# Altium schematic sheet commucational.SchDoc
size A1; Organization: Protel International P/L; Address1: L3, 12a Rodborough Rd; Address2: Frenchs Forest; Address3: NSW; Address4: Australia 2086
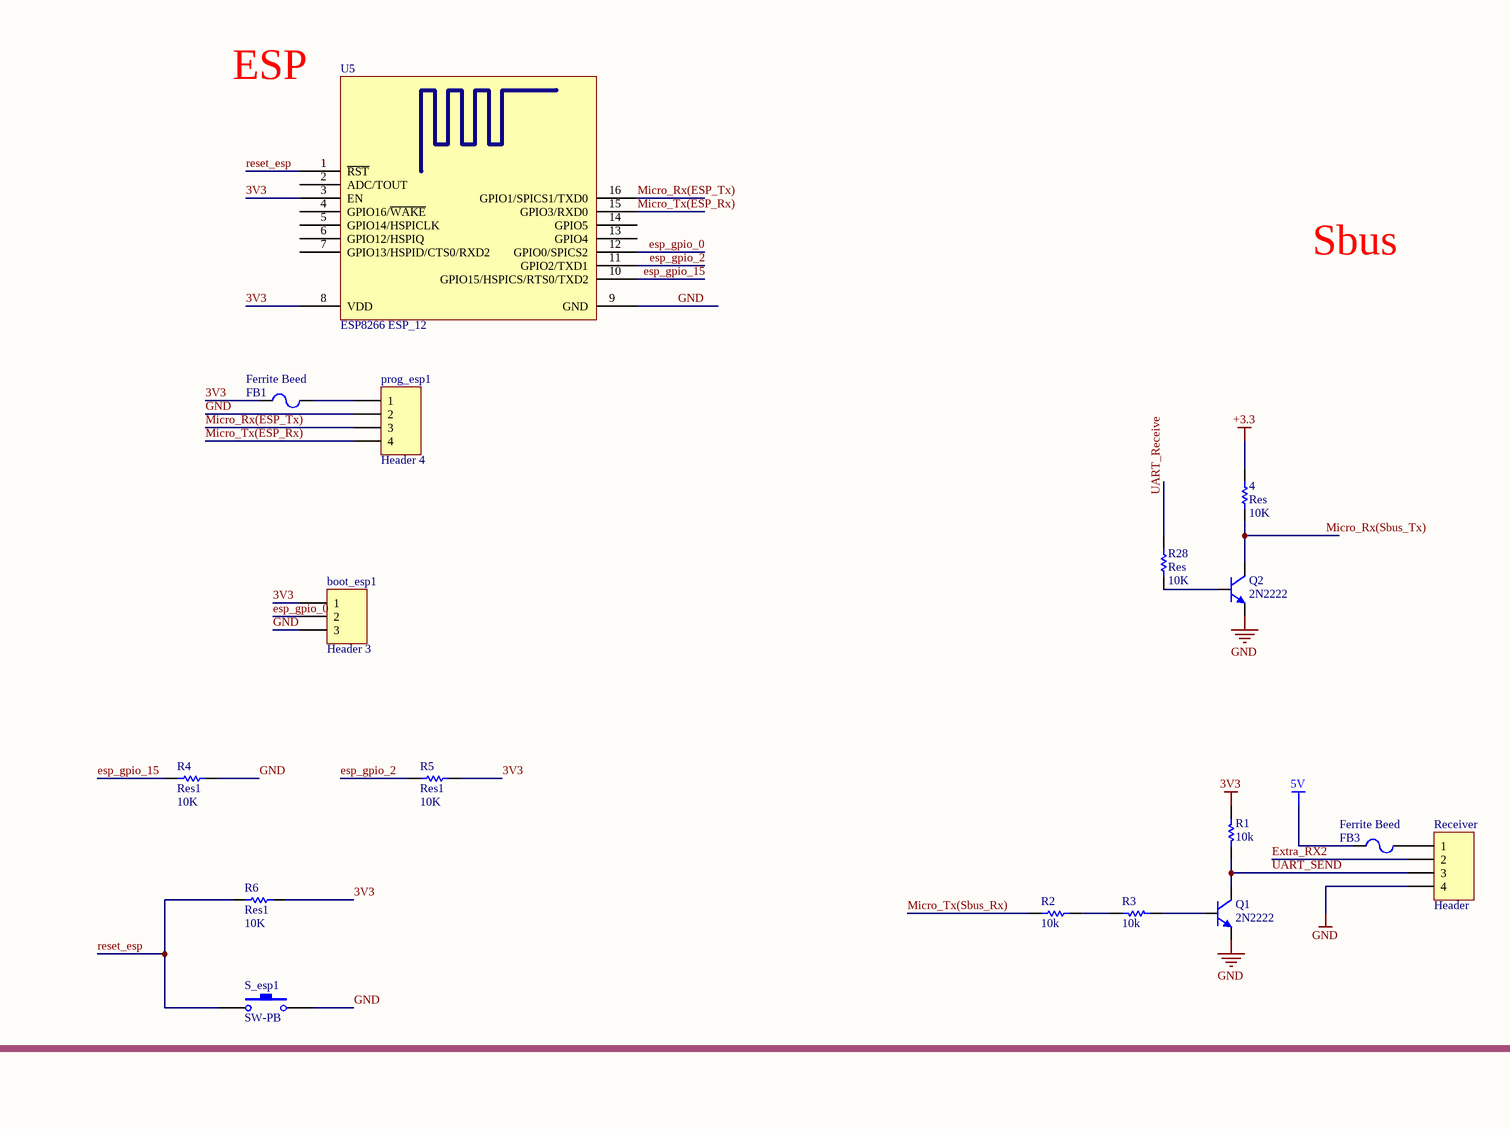
[diagram p0: commucational.SchDoc, top left]
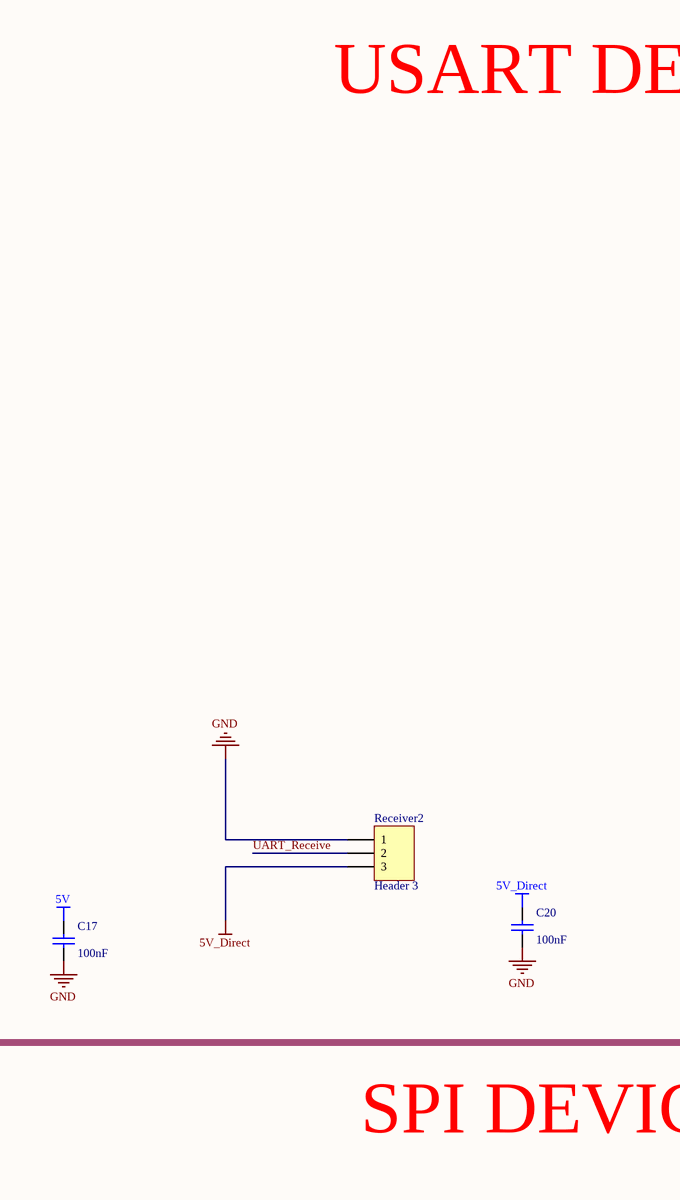
[diagram p1: commucational.SchDoc, top middle]
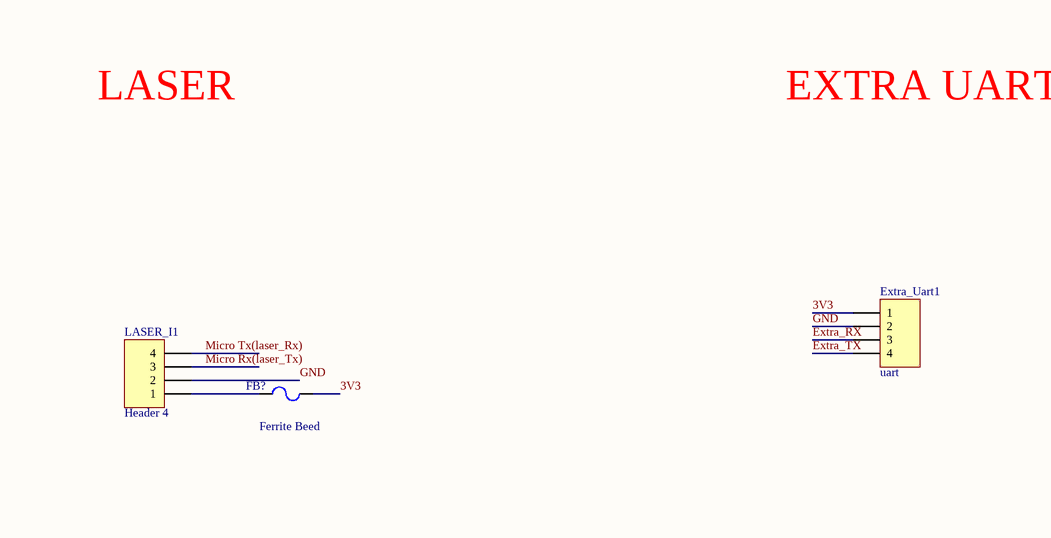
[diagram p2: commucational.SchDoc, top right]
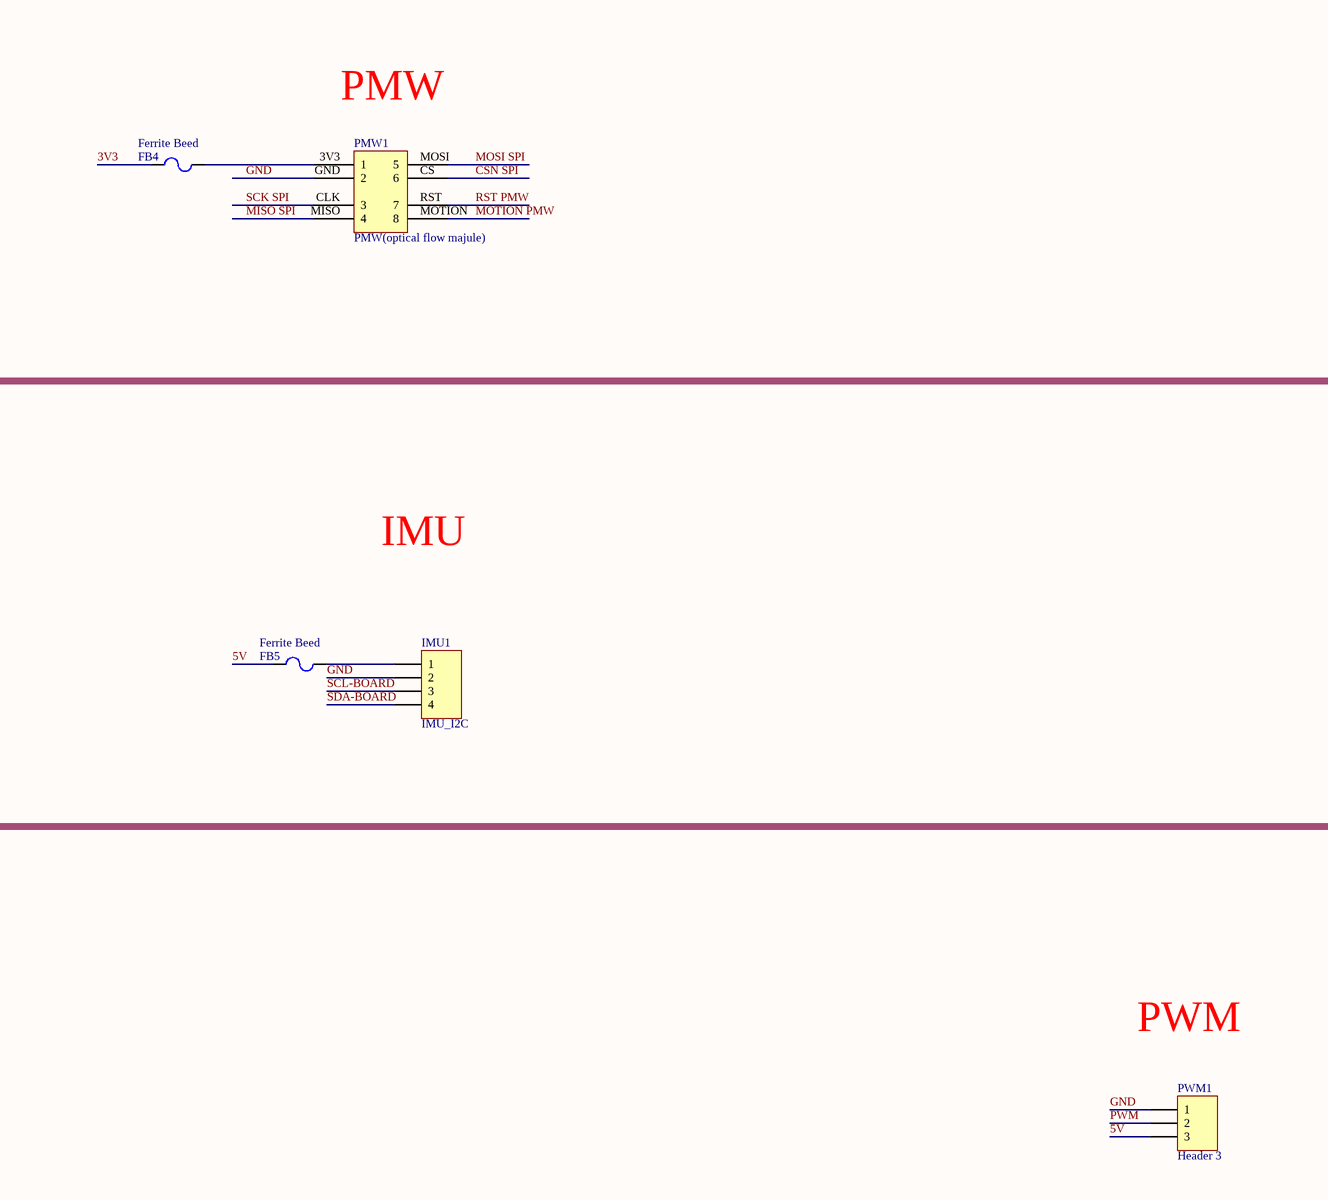
[diagram p3: commucational.SchDoc, bottom left]
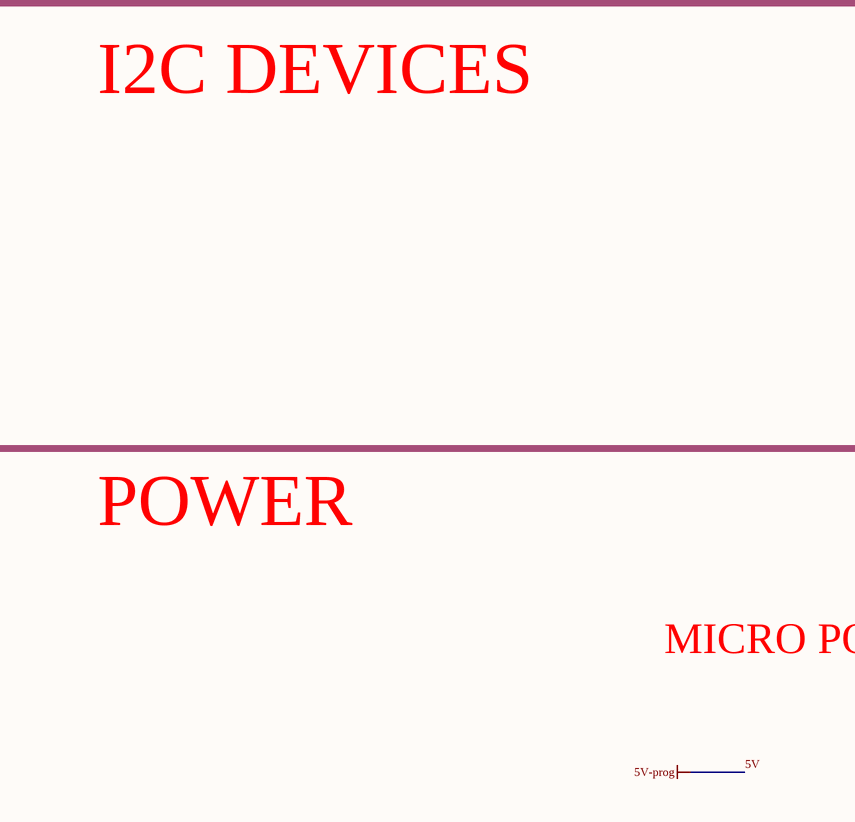
[diagram p4: commucational.SchDoc, bottom middle]

## Parts
4  Res  value 10K  [J1-0603]
boot_esp1  Header 3  [HDR1X3]
C17  value 100nF  [j1-0603]
C20  value 100nF  [j1-0603]
Extra_Uart1  uart  [SHeader 4]
FB1  Ferrite Beed  [6-0805_L]
FB3  Ferrite Beed  [6-0805_L]
FB4  Ferrite Beed  [6-0805_L]
FB5  Ferrite Beed  [6-0805_L]
FB?  Ferrite Beed  [6-0805_L]
IMU1  IMU_I2C  [SHeader 4]
LASER_I1  Header 4  [SHeader 4]
PMW1  PMW(optical flow majule)  [PMW(optical flow)]
prog_esp1  Header 4  [SHeader 4]
PWM1  Header 3  [SHeader 3]
Q1  2N2222  [SOT-23]
Q2  2N2222  [SOT-23]
R1  10k  [J1-0603]
R2  10k  [J1-0603]
R3  10k  [J1-0603]
R4  Res1  value 10K  [J1-0603]
R5  Res1  value 10K  [J1-0603]
R6  Res1  value 10K  [J1-0603]
R28  Res  value 10K  [J1-0603]
Receiver  Header  [SHeader 4]
Receiver2  Header 3  [SHeader 3]
S_esp1  SW-PB  [SW-PB-4P]
U5  ESP8266 ESP_12  [ESP8266 ESP_12]

## Nets
3V3: boot_esp1.1 Extra_Uart1.1 FB1.1 FB4.1 FB?.2 R1.2 R5.2 R6.2 U5.3(EN) U5.8(VDD)
5V: C17.2 FB3.1 FB5.1 PWM1.3  [also labelled 5V-prog]
5V_Direct: C20.2 Receiver2.3
+3.3: 4.2
GND: boot_esp1.3 C17.1 C20.1 Extra_Uart1.2 IMU1.2 LASER_I1.2 PMW1.GND(2) prog_esp1.2 PWM1.1 Q1.3(E) Q2.3(E) R4.2 Receiver.4 Receiver2.1 S_esp1.2 U5.9(GND)
CSN SPI: PMW1.CS(6)
esp_gpio_0: boot_esp1.2 U5.12(GPIO0/SPICS2)
esp_gpio_2: R5.1 U5.11(GPIO2/TXD1)
esp_gpio_15: R4.1 U5.10(GPIO15/HSPICS/RTS0/TXD2)
Extra_RX: Extra_Uart1.3
Extra_RX2: Receiver.2
Extra_TX: Extra_Uart1.4
Micro Rx(laser_Tx): LASER_I1.3
Micro Tx(laser_Rx): LASER_I1.4
Micro_Rx(ESP_Tx): prog_esp1.3 U5.16(GPIO1/SPICS1/TXD0)
Micro_Rx(Sbus_Tx): 4.1 Q2.1(C)
Micro_Tx(ESP_Rx): prog_esp1.4 U5.15(GPIO3/RXD0)
Micro_Tx(Sbus_Rx): R2.1
MISO SPI: PMW1.MISO(4)
MOSI SPI: PMW1.MOSI(5)
MOTION PMW: PMW1.MOTION(8)
PWM: PWM1.2
reset_esp: R6.1 S_esp1.1 U5.1(~{RST})
RST PMW: PMW1.RST(7)
SCK SPI: PMW1.CLK(3)
SCL-BOARD: IMU1.3
SDA-BOARD: IMU1.4
UART_Receive: R28.1 Receiver2.2
UART_SEND: Q1.1(C) R1.1 Receiver.3
NetFB1_2: FB1.2 prog_esp1.1
NetFB3_2: FB3.2 Receiver.1
NetFB4_2: FB4.2 PMW1.3V3(1)
NetFB5_2: FB5.2 IMU1.1
NetFB?_1: FB?.1 LASER_I1.1
NetQ1_2: Q1.2(B) R3.1
NetQ2_2: Q2.2(B) R28.2
NetR2_2: R2.2 R3.2

Not connected (* = marked no-connect by the designer): U5 2(ADC/TOUT) 4(GPIO16/~{WAKE}) 5(GPIO14/HSPICLK) 6(GPIO12/HSPIQ) 7(GPIO13/HSPID/CTS0/RXD2) 13(GPIO4) 14(GPIO5)

## Notes on the sheet
- ESP
- USART DEVICES
- Sbus
- LASER
- EXTRA UART
- SPI DEVICES
- PMW
- I2C DEVICES
- IMU
- POWER
- PWM
- MICRO POWER
- Title
- Size:
- Date:
- File:
- A1
- Number:
- Time:
- Revision:
- Sheet
- of

## Library data of the parts
4 R28 = Res: Semiconductor Resistor; Published: 8-Jun-2000; LatestRevisionDate: 17-Jul-2002; LatestRevisionNote: Re-released for DXP Platform.; PackageReference: AXIAL-0.5; Publisher: Altium Limited
boot_esp1 PWM1 Receiver2 = Header 3: Header, 3-Pin; LatestRevisionDate: 17-Jul-2002; LatestRevisionNote: Re-released for DXP Platform.; Publisher: Altium Limited
C17 C20 = Cap: Capacitor; Manufacturer: Generic Components; Class: Passive; Published: 08/06/2000; Publisher: Altium Hobart Technology Centre; SubClass: Capacitor
Extra_Uart1 IMU1 LASER_I1 = MHDR1X4: Header, 4-Pin; LatestRevisionDate: 17-Jul-2002; LatestRevisionNote: Re-released for DXP Platform.; Publisher: Altium Limited
FB1 FB3-FB5 FB? = Ferrite Beed: Code_IEC: 1005; Published: 8-Jun-2000; LatestRevisionDate: 17-Jul-2002; LatestRevisionNote: Re-released for DXP Platform.; PackageReference: 0402-A; Publisher: Altium Limited; Code_JEITA: 0402
prog_esp1 Receiver = Header 4: Header, 4-Pin; LatestRevisionDate: 17-Jul-2002; LatestRevisionNote: Re-released for DXP Platform.; Publisher: Altium Limited
Q1 Q2 = 2N2222: NPN Bipolar Transistor; Published: 8-Jun-2000; LatestRevisionDate: 17-Jul-2002; LatestRevisionNote: Re-released for DXP Platform.; PackageReference: TO-226; Publisher: Altium Limited; Code_JEDEC: TO-226-AA
R1-R3 = Res1: Resistor; Value: 1K; Published: 8-Jun-2000; LatestRevisionDate: 17-Jul-2002; LatestRevisionNote: Re-released for DXP Platform.; PackageReference: AXIAL-0.3; Publisher: Altium Limited
R4-R6 = Res1: Resistor; Published: 8-Jun-2000; LatestRevisionDate: 17-Jul-2002; LatestRevisionNote: Re-released for DXP Platform.; PackageReference: AXIAL-0.3; Publisher: Altium Limited; PackageDescription: Axial Device, Thru-Hole; 2 Leads; 0.3 in Pin Spacing
S_esp1 = SW-PB: Switch; Published: 24-Mar-1999; LatestRevisionDate: 17-Jul-2002; LatestRevisionNote: Re-released for DXP Platform.; PackageReference: SPST-2; Publisher: Altium Limited
U5 = ESP8266 ESP_12: ESP8266 ESP-12; IC: ESP8266-EX; Vendor: Ai-thinker; LatestReviewer: Zion Blue; Published: 14-Apr-2015; Publisher: Cynetik Group; LatestRevisionData: 14-Apr-2015; LatestRevisionNote: Include 3D body and Footprint